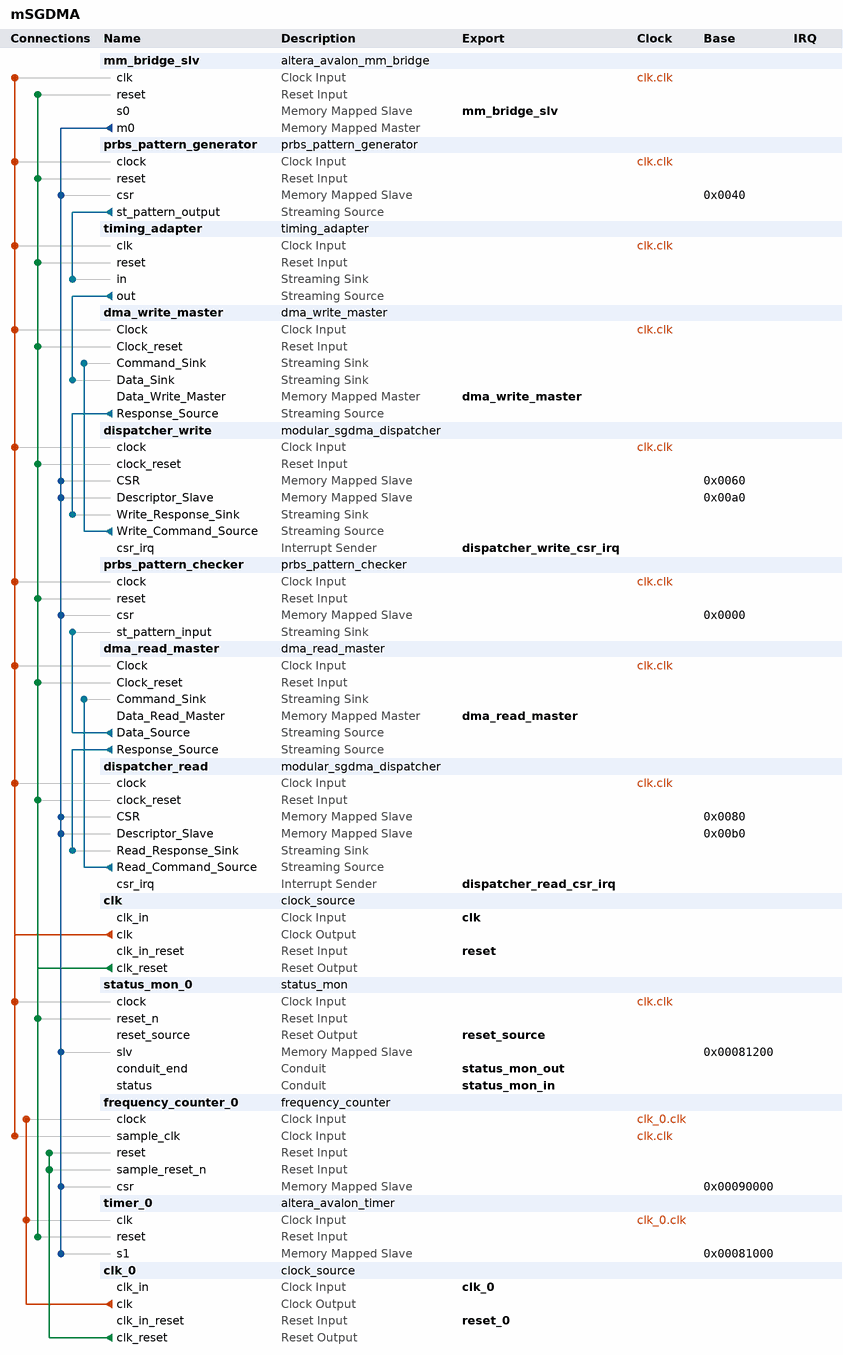
[diagram p0: system contents]
# Platform Designer (Qsys) system mSGDMA, Arria V 5AGXFB3H4F35C5ES
# Parameters at their usual value, and those the tool derives, are not listed.
package require -exact qsys 12.1
create_system mSGDMA
set_project_property DEVICE_FAMILY {Arria V}
set_project_property DEVICE 5AGXFB3H4F35C5ES

add_instance mm_bridge_slv altera_avalon_mm_bridge 12.1
set_instance_parameter_value mm_bridge_slv DATA_WIDTH 32
set_instance_parameter_value mm_bridge_slv ADDRESS_WIDTH 20
set_instance_parameter_value mm_bridge_slv ADDRESS_UNITS SYMBOLS
set_instance_parameter_value mm_bridge_slv MAX_PENDING_RESPONSES 4

add_instance prbs_pattern_generator prbs_pattern_generator 1.1
set_instance_parameter_value prbs_pattern_generator DATA_WIDTH 128
set_instance_parameter_value prbs_pattern_generator PRBS_WIDTH 32

add_instance timing_adapter timing_adapter 12.1
set_instance_parameter_value timing_adapter inBitsPerSymbol 8
set_instance_parameter_value timing_adapter inChannelWidth 0
set_instance_parameter_value timing_adapter inErrorWidth 0
set_instance_parameter_value timing_adapter inMaxChannel 0
set_instance_parameter_value timing_adapter inReadyLatency 1
set_instance_parameter_value timing_adapter inSymbolsPerBeat 16
set_instance_parameter_value timing_adapter inUseEmptyPort AUTO
set_instance_parameter_value timing_adapter inUsePackets false
set_instance_parameter_value timing_adapter inUseReady true
set_instance_parameter_value timing_adapter inUseValid true
set_instance_parameter_value timing_adapter outReadyLatency 0
set_instance_parameter_value timing_adapter outUseReady true
set_instance_parameter_value timing_adapter outUseValid true

add_instance dma_write_master dma_write_master 1.0
set_instance_parameter_value dma_write_master DATA_WIDTH 128
set_instance_parameter_value dma_write_master LENGTH_WIDTH 31
set_instance_parameter_value dma_write_master FIFO_DEPTH 128
set_instance_parameter_value dma_write_master STRIDE_ENABLE 0
set_instance_parameter_value dma_write_master GUI_STRIDE_WIDTH 1
set_instance_parameter_value dma_write_master BURST_ENABLE 1
set_instance_parameter_value dma_write_master GUI_MAX_BURST_COUNT 32
set_instance_parameter_value dma_write_master GUI_PROGRAMMABLE_BURST_ENABLE 0
set_instance_parameter_value dma_write_master GUI_BURST_WRAPPING_SUPPORT 0
set_instance_parameter_value dma_write_master TRANSFER_TYPE {Full Word Accesses Only}
set_instance_parameter_value dma_write_master PACKET_ENABLE 0
set_instance_parameter_value dma_write_master ERROR_ENABLE 0
set_instance_parameter_value dma_write_master ERROR_WIDTH 8
set_instance_parameter_value dma_write_master ADDRESS_WIDTH 32
set_instance_parameter_value dma_write_master FIFO_SPEED_OPTIMIZATION 1

add_instance dispatcher_write modular_sgdma_dispatcher 1.0
set_instance_parameter_value dispatcher_write MODE 2
set_instance_parameter_value dispatcher_write GUI_RESPONSE_PORT 2
set_instance_parameter_value dispatcher_write DESCRIPTOR_FIFO_DEPTH 8
set_instance_parameter_value dispatcher_write ENHANCED_FEATURES 0
set_instance_parameter_value dispatcher_write CSR_ADDRESS_WIDTH 3

add_instance prbs_pattern_checker prbs_pattern_checker 1.1
set_instance_parameter_value prbs_pattern_checker DATA_WIDTH 128
set_instance_parameter_value prbs_pattern_checker PRBS_WIDTH 32

add_instance dma_read_master dma_read_master 1.0
set_instance_parameter_value dma_read_master DATA_WIDTH 128
set_instance_parameter_value dma_read_master LENGTH_WIDTH 31
set_instance_parameter_value dma_read_master FIFO_DEPTH 128
set_instance_parameter_value dma_read_master STRIDE_ENABLE 0
set_instance_parameter_value dma_read_master GUI_STRIDE_WIDTH 1
set_instance_parameter_value dma_read_master BURST_ENABLE 1
set_instance_parameter_value dma_read_master GUI_MAX_BURST_COUNT 32
set_instance_parameter_value dma_read_master GUI_PROGRAMMABLE_BURST_ENABLE 0
set_instance_parameter_value dma_read_master GUI_BURST_WRAPPING_SUPPORT 0
set_instance_parameter_value dma_read_master TRANSFER_TYPE {Full Word Accesses Only}
set_instance_parameter_value dma_read_master PACKET_ENABLE 0
set_instance_parameter_value dma_read_master ERROR_ENABLE 0
set_instance_parameter_value dma_read_master ERROR_WIDTH 8
set_instance_parameter_value dma_read_master CHANNEL_ENABLE 0
set_instance_parameter_value dma_read_master CHANNEL_WIDTH 8
set_instance_parameter_value dma_read_master ADDRESS_WIDTH 32
set_instance_parameter_value dma_read_master FIFO_SPEED_OPTIMIZATION 1

add_instance dispatcher_read modular_sgdma_dispatcher 1.0
set_instance_parameter_value dispatcher_read MODE 1
set_instance_parameter_value dispatcher_read GUI_RESPONSE_PORT 0
set_instance_parameter_value dispatcher_read DESCRIPTOR_FIFO_DEPTH 8
set_instance_parameter_value dispatcher_read ENHANCED_FEATURES 0
set_instance_parameter_value dispatcher_read CSR_ADDRESS_WIDTH 3

add_instance clk clock_source 12.1
set_instance_parameter_value clk clockFrequency 150000000

add_instance status_mon_0 status_mon 1.0

add_instance frequency_counter_0 frequency_counter 1.0
set_instance_parameter_value frequency_counter_0 SYSTEM_CLK_FREQ_PICO_SEC 20000

add_instance timer_0 altera_avalon_timer 12.1
set_instance_parameter_value timer_0 period 1
set_instance_parameter_value timer_0 periodUnits MSEC
set_instance_parameter_value timer_0 timerPreset CUSTOM

add_instance clk_0 clock_source 12.1
set_instance_parameter_value clk_0 clockFrequency 50000000

# connections
add_connection clk.clk dispatcher_read.clock clock
add_connection clk.clk dispatcher_write.clock clock
add_connection clk.clk dma_read_master.Clock clock
add_connection clk.clk dma_write_master.Clock clock
add_connection clk.clk frequency_counter_0.sample_clk clock
add_connection clk.clk mm_bridge_slv.clk clock
add_connection clk.clk prbs_pattern_checker.clock clock
add_connection clk.clk prbs_pattern_generator.clock clock
add_connection clk.clk status_mon_0.clock clock
add_connection clk.clk timing_adapter.clk clock
add_connection clk_0.clk frequency_counter_0.clock clock
add_connection clk_0.clk timer_0.clk clock
add_connection clk.clk_reset dispatcher_read.clock_reset reset
add_connection clk.clk_reset dispatcher_write.clock_reset reset
add_connection clk.clk_reset dma_read_master.Clock_reset reset
add_connection clk.clk_reset dma_write_master.Clock_reset reset
add_connection clk.clk_reset mm_bridge_slv.reset reset
add_connection clk.clk_reset prbs_pattern_checker.reset reset
add_connection clk.clk_reset prbs_pattern_generator.reset reset
add_connection clk.clk_reset status_mon_0.reset_n reset
add_connection clk.clk_reset timer_0.reset reset
add_connection clk.clk_reset timing_adapter.reset reset
add_connection clk_0.clk_reset frequency_counter_0.reset reset
add_connection clk_0.clk_reset frequency_counter_0.sample_reset_n reset
add_connection mm_bridge_slv.m0 dispatcher_read.CSR avalon
set_connection_parameter_value mm_bridge_slv.m0/dispatcher_read.CSR baseAddress 0x0080
add_connection mm_bridge_slv.m0 dispatcher_read.Descriptor_Slave avalon
set_connection_parameter_value mm_bridge_slv.m0/dispatcher_read.Descriptor_Slave baseAddress 0x00b0
add_connection mm_bridge_slv.m0 dispatcher_write.CSR avalon
set_connection_parameter_value mm_bridge_slv.m0/dispatcher_write.CSR baseAddress 0x0060
add_connection mm_bridge_slv.m0 dispatcher_write.Descriptor_Slave avalon
set_connection_parameter_value mm_bridge_slv.m0/dispatcher_write.Descriptor_Slave baseAddress 0x00a0
add_connection mm_bridge_slv.m0 frequency_counter_0.csr avalon
set_connection_parameter_value mm_bridge_slv.m0/frequency_counter_0.csr baseAddress 0x00090000
add_connection mm_bridge_slv.m0 prbs_pattern_checker.csr avalon
set_connection_parameter_value mm_bridge_slv.m0/prbs_pattern_checker.csr baseAddress 0x0000
add_connection mm_bridge_slv.m0 prbs_pattern_generator.csr avalon
set_connection_parameter_value mm_bridge_slv.m0/prbs_pattern_generator.csr baseAddress 0x0040
add_connection mm_bridge_slv.m0 status_mon_0.slv avalon
set_connection_parameter_value mm_bridge_slv.m0/status_mon_0.slv baseAddress 0x00081200
add_connection mm_bridge_slv.m0 timer_0.s1 avalon
set_connection_parameter_value mm_bridge_slv.m0/timer_0.s1 baseAddress 0x00081000
add_connection dispatcher_read.Read_Command_Source dma_read_master.Command_Sink avalon_streaming
add_connection dispatcher_write.Write_Command_Source dma_write_master.Command_Sink avalon_streaming
add_connection dma_read_master.Data_Source prbs_pattern_checker.st_pattern_input avalon_streaming
add_connection dma_read_master.Response_Source dispatcher_read.Read_Response_Sink avalon_streaming
add_connection dma_write_master.Response_Source dispatcher_write.Write_Response_Sink avalon_streaming
add_connection prbs_pattern_generator.st_pattern_output timing_adapter.in avalon_streaming
add_connection timing_adapter.out dma_write_master.Data_Sink avalon_streaming

# exported interfaces
add_interface mm_bridge_slv avalon slave
set_interface_property mm_bridge_slv EXPORT_OF mm_bridge_slv.s0
add_interface reset reset sink
set_interface_property reset EXPORT_OF clk.clk_in_reset
add_interface clk clock sink
set_interface_property clk EXPORT_OF clk.clk_in
add_interface dma_read_master avalon master
set_interface_property dma_read_master EXPORT_OF dma_read_master.Data_Read_Master
add_interface dma_write_master avalon master
set_interface_property dma_write_master EXPORT_OF dma_write_master.Data_Write_Master
add_interface dispatcher_write_csr_irq interrupt sender
set_interface_property dispatcher_write_csr_irq EXPORT_OF dispatcher_write.csr_irq
add_interface dispatcher_read_csr_irq interrupt sender
set_interface_property dispatcher_read_csr_irq EXPORT_OF dispatcher_read.csr_irq
add_interface clk_0 clock sink
set_interface_property clk_0 EXPORT_OF clk_0.clk_in
add_interface reset_0 reset sink
set_interface_property reset_0 EXPORT_OF clk_0.clk_in_reset
add_interface status_mon_out conduit end
set_interface_property status_mon_out EXPORT_OF status_mon_0.conduit_end
add_interface status_mon_in conduit end
set_interface_property status_mon_in EXPORT_OF status_mon_0.status
add_interface reset_source reset source
set_interface_property reset_source EXPORT_OF status_mon_0.reset_source

save_system mSGDMA.qsys
